# Altium schematic sheet Misc.SchDoc
size A; SheetNumber: 3; SheetTotal: 4
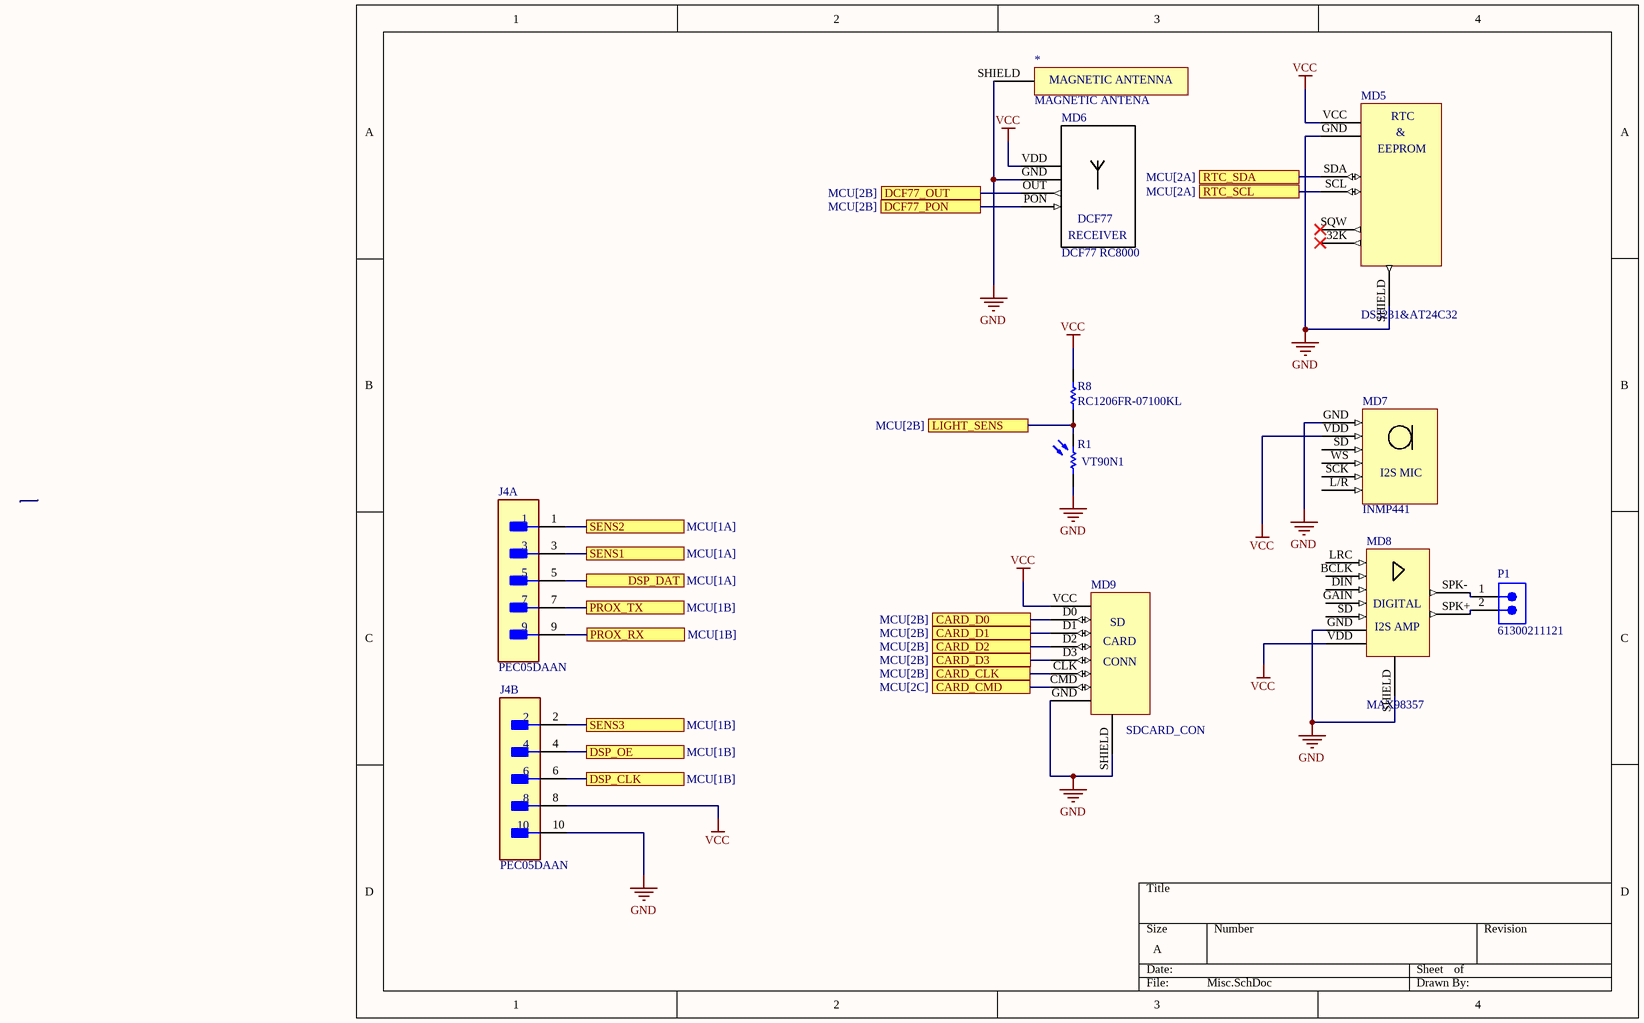
[diagram p0: Misc.SchDoc]

## Parts
*  MAGNETIC ANTENA  [MAGNETIC ANTENA]
J4  PEC05DAAN  [FP-PEC05DAAN-MFG]  (parts A,B of 2)
MD5  DS3231&AT24C32  [DS3231_MODULE]
MD6  DCF77 RC8000  [DFC77_MODULE]
MD7  INMP441  [INMP441_i2s_microphone_module]
MD8  MAX98357  [MAX98357]
MD9  SDCARD_CON  [SDCARD_CONN]
P1  61300211121  [61300211121]
R1  VT90N1  [EXCE-VT90N1]
R8  RC1206FR-07100KL  [RESC3116X65X40ML10T20]

## Ports
CARD_CLK (see MCU[2B]), CARD_CMD (see MCU[2C]), CARD_D0 (see MCU[2B]), CARD_D1 (see MCU[2B]), CARD_D2 (see MCU[2B]), CARD_D3 (see MCU[2B]), DCF77_OUT (see MCU[2B]), DCF77_PON (see MCU[2B]), DSP_CLK (see MCU[1B]), DSP_DAT (see MCU[1A]), DSP_OE (see MCU[1B]), LIGHT_SENS (see MCU[2B]), PROX_RX (see MCU[1B]), PROX_TX (see MCU[1B]), RTC_SCL (see MCU[2A]), RTC_SDA (see MCU[2A]), SENS1 (see MCU[1A]), SENS2 (see MCU[1A]), SENS3 (see MCU[1B])

## Nets
GND: *.SHIELD J4.10 MD5.GND MD5.SHIELD MD6.GND MD7.GND MD8.GND MD8.SHIELD MD9.GND MD9.SHIELD R1.1
VCC: J4.8 MD5.VCC MD6.VDD MD7.VDD MD8.VDD MD9.VCC R8.2
CARD_CLK: MD9.CLK ; port CARD_CLK
CARD_CMD: MD9.CMD ; port CARD_CMD
CARD_D0: MD9.D0 ; port CARD_D0
CARD_D1: MD9.D1 ; port CARD_D1
CARD_D2: MD9.D2 ; port CARD_D2
CARD_D3: MD9.D3 ; port CARD_D3
DCF77_OUT: MD6.OUT ; port DCF77_OUT
DCF77_PON: MD6.PON ; port DCF77_PON
DSP_CLK: J4.6 ; port DSP_CLK
DSP_DAT: J4.5 ; port DSP_DAT
DSP_OE: J4.4 ; port DSP_OE
LIGHT_SENS: R1.2 R8.1 ; port LIGHT_SENS
PROX_RX: J4.9 ; port PROX_RX
PROX_TX: J4.7 ; port PROX_TX
RTC_SCL: MD5.SCL ; port RTC_SCL
RTC_SDA: MD5.SDA ; port RTC_SDA
SENS1: J4.3 ; port SENS1
SENS2: J4.1 ; port SENS2
SENS3: J4.2 ; port SENS3
NetMD8_SPK+: MD8.SPK+ P1.2
NetMD8_SPK-: MD8.SPK- P1.1

Not connected (* = marked no-connect by the designer): MD5 32K* SQW*; MD7 L/R SCK SD WS; MD8 BCLK DIN GAIN LRC SD

## Notes on the sheet
- (in symbol DCF77_MODULE) DCF77; RECEIVER
- (in symbol INMP441_I2S_MIC) I2S MIC
- (in symbol MAGNETIC ANTENA) MAGNETIC ANTENNA
- (in symbol MAX98357) DIGITAL; I2S AMP
- (in symbol RTC DS3231_MODULE) RTC; &; EEPROM
- (in symbol SDCARD_CON) SD; CARD; CONN

## Library data of the parts
J4 = CMP-25680-000034-1: CONN HEADER VERT 10POS 2.54MM; Pitch: 0.1inch; Number of Positions: 10; Gender: Male; Connector Type: Male Pin; Contact Type: Male Pin; Height: 2.54mm; Termination: Solder; Packaging: Bulk; Housing Material: Plastic; Contact Mating Length: 0.23inch; Width: 5.08mm; Row Spacing: 0.1inch; Housing Color: Black; Mount: Through Hole; Contact Plating: Tin; Contact Material: Bronze; Color: Black; Package Quantity: 1; Length: 12.7mm; Lead Free: Lead Free; Number of Rows: 2; Number of Contacts: 10
MD5 = RTC DS3231_MODULE
MD6 = DCF77_MODULE
MD7 = INMP441_I2S_MIC: Digital microphone
P1 = CMP-1712-00002-6: NexarPartId: 20081794; Number of Contacts: 2; Pitch: 2.54mm; Connector Type: Male Pin; Voltage Rating: 250V; Current Rating: 3A; Gender: Male; Contact Resistance: 20mΩ; Height: 8.94mm; Lead Free: Lead Free; Number of Pins: 2; Termination: Through Hole; RoHS: Compliant; Lead Pitch: 2.54mm; REACH SVHC: No SVHC; Housing Material: PBT; Contact Mating Length: 5.9944mm; Min Operating Temperature: -40°C; Orientation: Vertical; Contact Material: Copper; Contact Gender: Male; Max Operating Temperature: 125°C; Number of Rows: 1; Number of Positions: 2; Packaging: Bulk; Contact Plating: Gold; Mount: Through Hole; Color: Black; Operating Supply Voltage: 250V
R1 = CMP-2000-07406-1: Photoconductive Resistor, 200 kOhm, 100 V, 80 mW, -40 to 75 degC, 2-Pin THD, RoHS; Manufacturer: Excelitas Technology; SVHC: Cadmiumchloride(15-Jun-2015); Power Rating: 80mW; Resistance @ Lux: 12kohm; Voltage Rating: 100V; Product Range: -; Datasheet Version: 09/2006; Resistor Case Style: -; Operating Temperature Max: 75°C; Package Reference: VT90N1; Datasheet URL: http://datasheet.octopart.com/VT90N1-Excelitas-datasheet-10388451.pdf; Mounting Technology: ThroughHole; Operating Temperature Min: -40°C; Dark Resistance: 200kohm; Package Description: 2-Pin Through Hole Device, Body Width 4.17 mm (Max), Height 2.29 mm; Manufacturer URL: http://www.excelitas.com/Pages/Index.aspx; Packaging: Each
R8 = CMP-2100-03674-1: Chip Resistor, 100 KOhm, +/- 1%, 0.25 W, -55 to 155 degC, 1206 (3216 Metric), RoHS, Tape and Reel; Manufacturer: Yageo; Voltage Rating: 200V; Temperature Coefficient: 100ppm/degreesC; Power Rating: 250mW; Case Code (Metric): 3216; Composition: ThickFilm; Lead Free: LeadFree; Max Operating Temperature: 155degC; Case/Package: 1206; Min Operating Temperature: -55degC; Depth: 1.6mm; RoHSCompliant: true; Datasheet URL: http://www.yageo.com/NewPortal/yageodocoutput?fileName=/pdf/R-Chip/PYu-RC_Group_51_RoHS_L_5.pdf; Datasheet Version: Rev. 5, 10/2016; Package Reference: 1206.0; Packaging: TapeandReel; Resistance: 100KOhm; Manufacturer URL: http://www.yageo.com/; Tolerance: 1%; Height: 0.55mm; REACH SVHC: NoSVHC; Case Code (Imperial): 1206; Length: 3.1mm; Package Description: 2-Pin Surface Mount Device, Body 3.1 x 1.6 mm; Termination: SMD/SMT